# Altium schematic sheet Kill_Switch_Fuse.SchDoc
size A
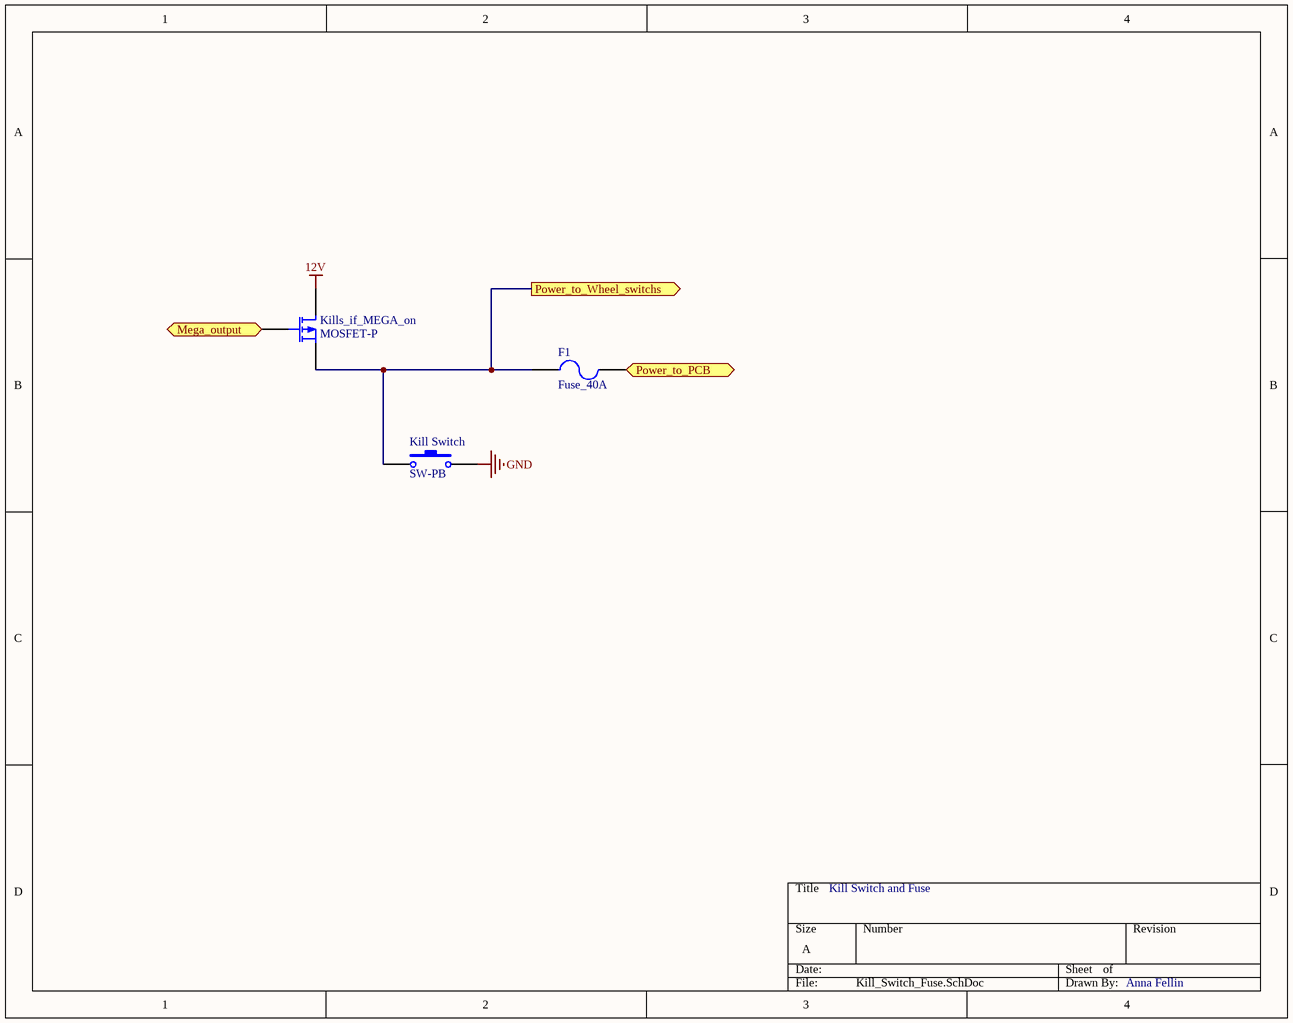
[diagram p0: Kill_Switch_Fuse.SchDoc]

## Parts
F1  Fuse_40A  [PIN-W2/E2.8]
Kill_Switch  SW-PB  [SPST-2]
Kills_if_MEGA_on  MOSFET-P  [E3]

## Ports
Mega_output (in), Power_to_PCB (out), Power_to_Wheel_switchs (out)

## Nets
12V: Kills_if_MEGA_on.1(D)
GND: Kill_Switch.2
Mega_output: Kills_if_MEGA_on.2(G) ; port Mega_output
Power_to_PCB: F1.2 ; port Power_to_PCB
Power_to_Wheel_switchs: F1.1 Kill_Switch.1 Kills_if_MEGA_on.3(S) ; port Power_to_Wheel_switchs

## Notes on the sheet
- Kill Switch and Fuse
- Anna Fellin

## Library data of the parts
F1 = Fuse 2: Fuse; Published: 8-Jun-2000; LatestRevisionDate: 17-Jul-2002; LatestRevisionNote: Re-released for DXP Platform.; PackageReference: PIN-W2/E2.8; Publisher: Altium Limited; PackageDescription: Thru-Hole; 2 Leads
Kill_Switch = SW-PB: Switch; Published: 24-Mar-1999; LatestRevisionDate: 17-Jul-2002; LatestRevisionNote: Re-released for DXP Platform.; PackageReference: SPST-2; Publisher: Altium Limited; PackageDescription: Switch; 2 Leads
Kills_if_MEGA_on = MOSFET-P: P-Channel MOSFET; Published: 8-Jun-2000; LatestRevisionDate: 17-Jul-2002; LatestRevisionNote: Re-released for DXP Platform.; PackageVersion: 1995/1996; PackageReference: E3; Publisher: Altium Limited; PackageDescription: TO, Flat Index; 3 In-Line, Axial Leads; Body Dia. 4.6mm; Lead Dia. 0.5 mm (max)